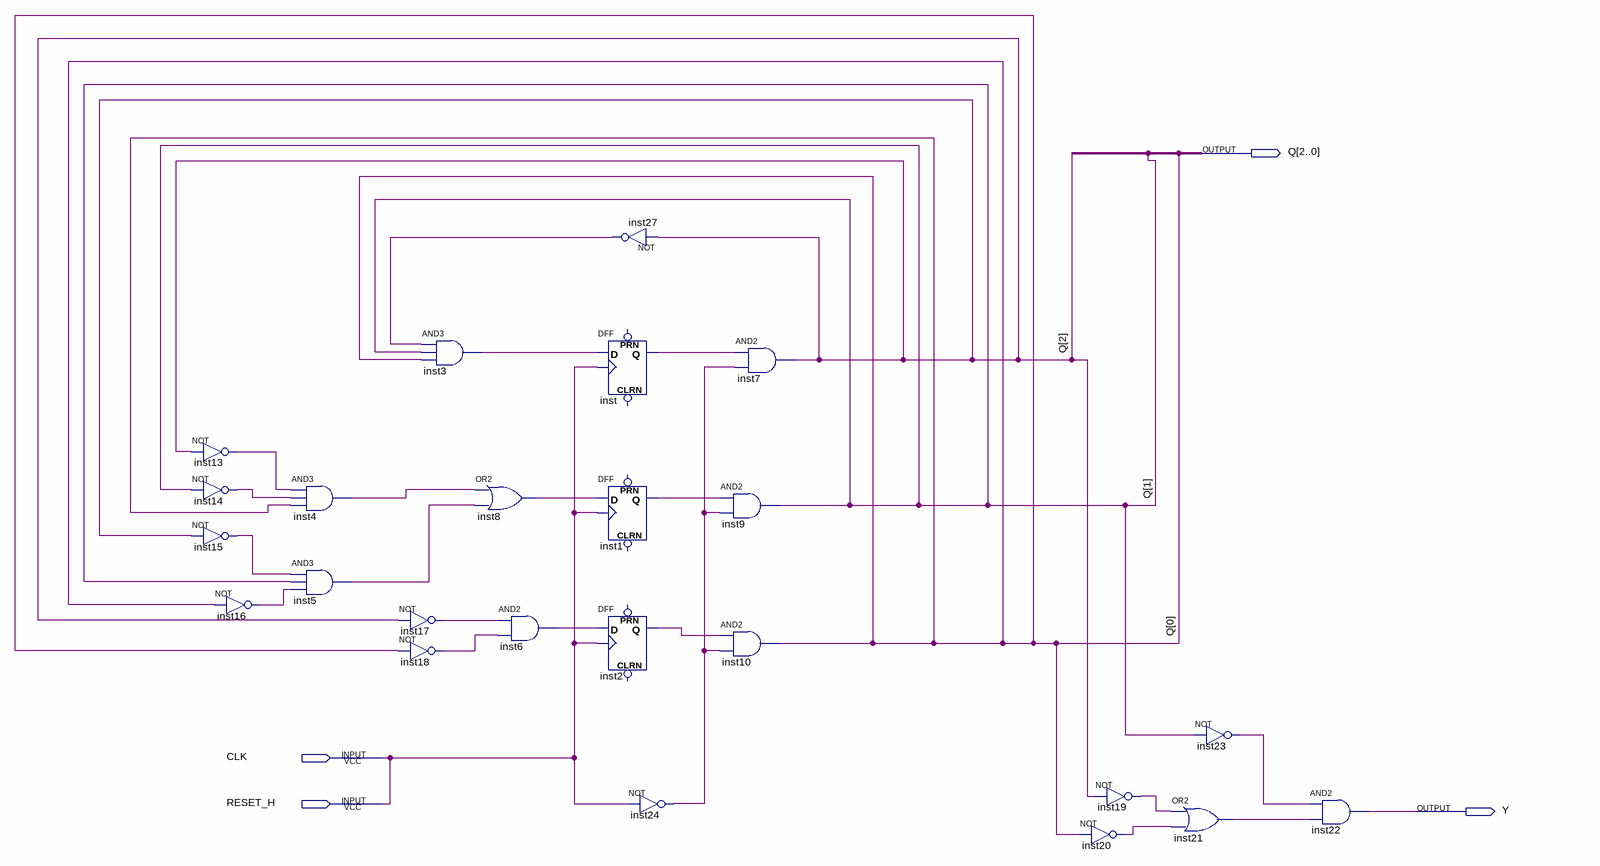
[diagram p0: schematic sheet]
// Quartus schematic FSM_5states.bdf as structural Verilog: 24 symbols, 4 pins
module FSM_5states (
  input  CLK,
  input  RESET_H,
  output [2:0] Q,
  output Y
);

  wire inst1_q, inst2_q, inst3_out, inst4_out, inst5_out, inst6_out, inst8_out, inst13_out, inst14_out,
       inst15_out, inst16_out, inst17_out, inst18_out, inst19_out, inst20_out, inst21_out, inst23_out,
       inst24_out, inst27_out, inst_q;

  not inst13 (inst13_out, Q[2]);
  not inst14 (inst14_out, Q[1]);
  not inst15 (inst15_out, Q[2]);
  not inst16 (inst16_out, Q[0]);
  and inst4 (inst4_out, inst13_out, inst14_out, Q[0]);
  and inst5 (inst5_out, inst15_out, Q[1], inst16_out);
  not inst17 (inst17_out, Q[2]);
  not inst18 (inst18_out, Q[0]);
  and inst3 (inst3_out, inst27_out, Q[1], Q[0]);
  or inst8 (inst8_out, inst4_out, inst5_out);
  and inst6 (inst6_out, inst17_out, inst18_out);
  not inst27 (inst27_out, Q[2]);
  DFF inst (.CLK(CLK), .D(inst3_out), .Q(inst_q));  // open: CLRN, PRN
  DFF inst1 (.CLK(CLK), .D(inst8_out), .Q(inst1_q));  // open: CLRN, PRN
  DFF inst2 (.CLK(CLK), .D(inst6_out), .Q(inst2_q));  // open: CLRN, PRN
  not inst24 (inst24_out, CLK);
  and inst7 (Q[2], inst_q, inst24_out);
  and inst9 (Q[1], inst1_q, inst24_out);
  and inst10 (Q[0], inst2_q, inst24_out);
  not inst20 (inst20_out, Q[0]);
  not inst19 (inst19_out, Q[2]);
  not inst23 (inst23_out, Q[1]);
  or inst21 (inst21_out, inst19_out, inst20_out);
  and inst22 (Y, inst23_out, inst21_out);

  assign RESET_H = CLK;
endmodule
